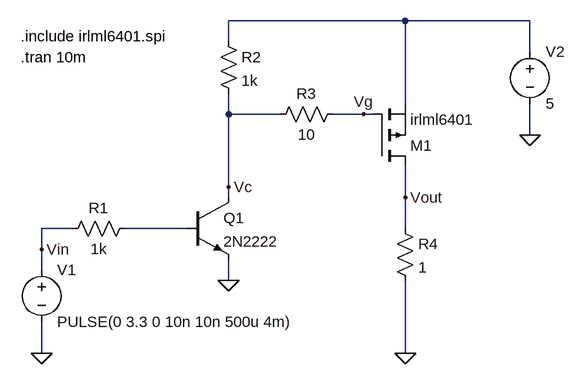
[diagram p0: schematic bjt_pmos.asc]
bjt_pmos.asc, the LTspice schematic file:
Version 4
SHEET 1 1040 680
WIRE 496 -1056 224 -1056
WIRE 688 -1056 496 -1056
WIRE 224 -1024 224 -1056
WIRE 688 -1008 688 -1056
WIRE 496 -928 496 -1056
WIRE 224 -912 224 -944
WIRE 304 -912 224 -912
WIRE 432 -912 384 -912
WIRE 448 -912 432 -912
WIRE 688 -880 688 -928
WIRE 224 -800 224 -912
WIRE 224 -784 224 -800
WIRE 496 -784 496 -832
WIRE -16 -736 -64 -736
WIRE 160 -736 64 -736
WIRE 496 -736 496 -784
WIRE -64 -704 -64 -736
WIRE -64 -672 -64 -704
WIRE 224 -656 224 -688
WIRE -64 -544 -64 -592
WIRE 496 -544 496 -656
FLAG -64 -544 0
FLAG 496 -544 0
FLAG 224 -656 0
FLAG 688 -880 0
FLAG -64 -704 Vin
FLAG 224 -800 Vc
FLAG 496 -784 Vout
FLAG 432 -912 Vg
SYMBOL voltage -64 -688 R0
SYMATTR InstName V1
SYMATTR Value PULSE(0 3.3 0 10n 10n 500u 4m)
SYMBOL res 80 -752 R90
WINDOW 0 0 56 VBottom 2
WINDOW 3 32 56 VTop 2
SYMATTR InstName R1
SYMATTR Value 1k
SYMBOL npn 160 -784 R0
SYMATTR InstName Q1
SYMATTR Value 2N2222
SYMBOL voltage 688 -1024 R0
SYMATTR InstName V2
SYMATTR Value 5
SYMBOL res 208 -1040 R0
SYMATTR InstName R2
SYMATTR Value 1k
SYMBOL pmos 448 -832 M180
SYMATTR InstName M1
SYMATTR Value irlml6401
SYMATTR Prefix X
SYMBOL res 288 -896 R270
WINDOW 0 32 56 VTop 2
WINDOW 3 0 56 VBottom 2
SYMATTR InstName R3
SYMATTR Value 10
SYMBOL res 480 -752 R0
SYMATTR InstName R4
SYMATTR Value 1
TEXT -96 -1000 Left 2 !.tran 10m
TEXT -96 -1032 Left 2 !.include irlml6401.spi

The netlist it stands for:
* bjt_pmos.asc
V1 Vin 0 PULSE(0 3.3 0 10n 10n 500u 4m)
R1 N002 Vin 1k
Q1 Vc N002 0 0 2N2222
V2 N001 0 5
R2 N001 Vc 1k
XM1 Vout Vg N001 irlml6401  ; pins D G S
R3 Vc Vg 10
R4 Vout 0 1
.model NPN NPN
.model PNP PNP
.lib standard.bjt
.tran 10m
.include irlml6401.spi
.backanno
.end